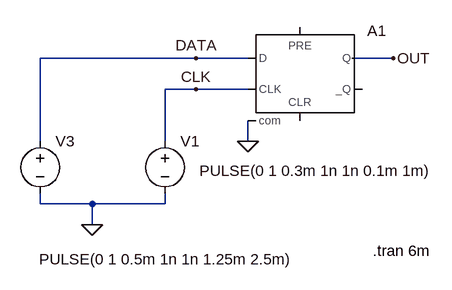
[diagram p0: schematic Fig_2-156_Logic_DFF-Latch.asc]
Fig_2-156_Logic_DFF-Latch.asc, the LTspice schematic file:
Version 4
SHEET 1 880 680
WIRE 80 144 -160 144
WIRE 160 144 80 144
WIRE 384 144 320 144
WIRE 80 192 32 192
WIRE 160 192 80 192
WIRE -160 272 -160 144
WIRE 32 272 32 192
WIRE 160 272 160 240
WIRE -160 368 -160 352
WIRE -80 368 -160 368
WIRE 32 368 32 352
WIRE 32 368 -80 368
WIRE -80 400 -80 368
FLAG 384 144 OUT
FLAG -80 400 0
FLAG 160 272 0
FLAG 80 144 DATA
FLAG 80 192 CLK
SYMBOL voltage 32 256 R0
WINDOW 3 53 61 Left 2
WINDOW 123 0 0 Left 2
WINDOW 39 0 0 Left 2
SYMATTR Value PULSE(0 1 0.3m 1n 1n 0.1m 1m)
SYMATTR InstName V1
SYMBOL voltage -160 256 R0
WINDOW 3 -2 197 Left 2
WINDOW 123 0 0 Left 2
WINDOW 39 0 0 Left 2
SYMATTR Value PULSE(0 1 0.5m 1n 1n 1.25m 2.5m)
SYMATTR InstName V3
SYMBOL Digital\\dflop 240 96 R0
SYMATTR InstName A1
TEXT 352 440 Left 2 !.tran 6m

The netlist it stands for:
* Fig_2-156_Logic_DFF-Latch.asc
V1 CLK 0 PULSE(0 1 0.3m 1n 1n 0.1m 1m)
V3 DATA 0 PULSE(0 1 0.5m 1n 1n 1.25m 2.5m)
A1 DATA 0 CLK 0 0 0 OUT 0 DFLOP
.tran 6m
.backanno
.end